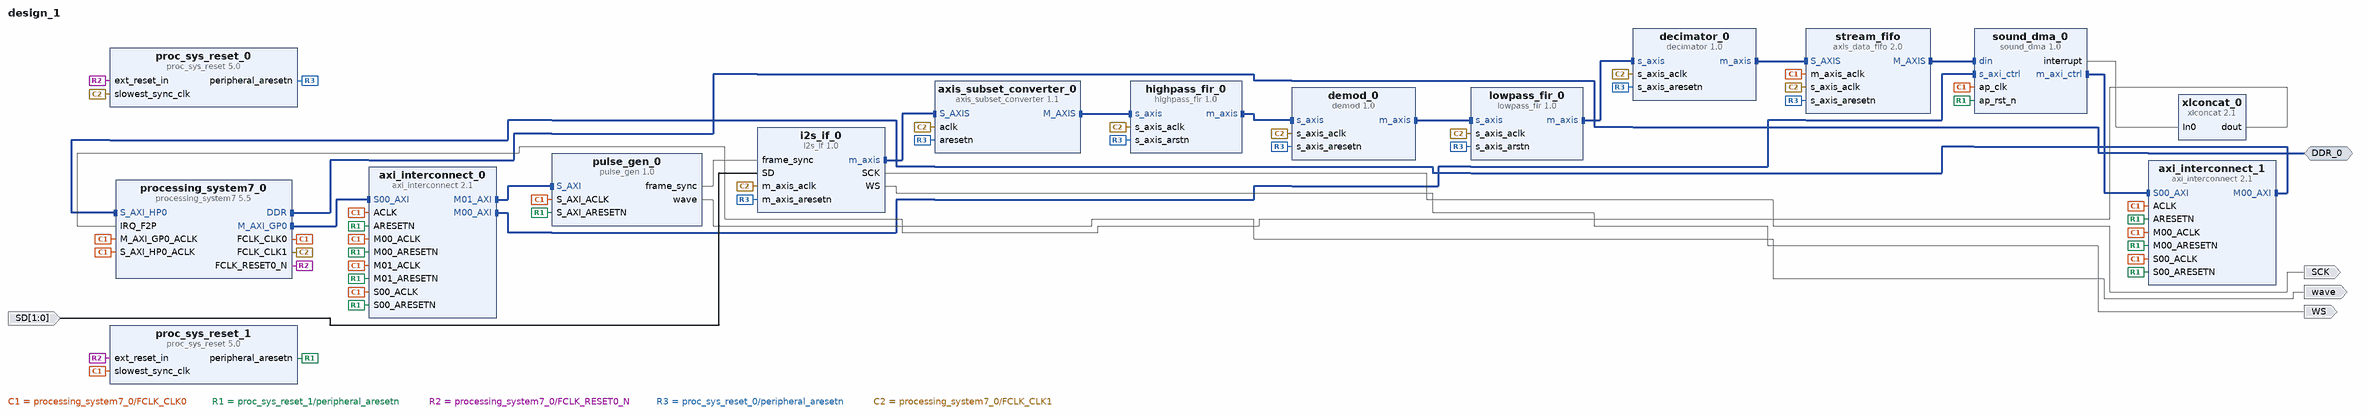
[diagram p0: block diagram of the top level]
# Vivado block design design_1, xc7z010clg400-1, Vivado 2019.1
create_bd_design design_1

create_bd_intf_port -mode Master -vlnv xilinx.com:interface:ddrx_rtl:1.0 DDR_0
create_bd_port -dir I -from 1 -to 0 SD
create_bd_port -dir O SCK
create_bd_port -dir O WS
create_bd_port -dir O wave

create_bd_cell -type ip -vlnv xilinx.com:ip:processing_system7:5.5 processing_system7_0
set_property -dict [list \
  CONFIG.PCW_ENET0_PERIPHERAL_CLKSRC External \
  CONFIG.PCW_ENET0_PERIPHERAL_ENABLE 0 \
  CONFIG.PCW_EN_CLK1_PORT 1 \
  CONFIG.PCW_FCLK_CLK0_BUF FALSE \
  CONFIG.PCW_FPGA0_PERIPHERAL_FREQMHZ 100 \
  CONFIG.PCW_FPGA1_PERIPHERAL_FREQMHZ 64 \
  CONFIG.PCW_FPGA_FCLK1_ENABLE 1 \
  CONFIG.PCW_GPIO_MIO_GPIO_ENABLE 0 \
  CONFIG.PCW_IRQ_F2P_INTR 1 \
  CONFIG.PCW_SD0_PERIPHERAL_ENABLE 0 \
  CONFIG.PCW_UART1_PERIPHERAL_ENABLE 1 \
  CONFIG.PCW_UART1_UART1_IO {MIO 24 .. 25} \
  CONFIG.PCW_UART_PERIPHERAL_FREQMHZ 100 \
  CONFIG.PCW_UIPARAM_DDR_BUS_WIDTH {16 Bit} \
  CONFIG.PCW_UIPARAM_DDR_FREQ_MHZ 533.333 \
  CONFIG.PCW_UIPARAM_DDR_PARTNO {MT41K256M16 RE-125} \
  CONFIG.PCW_USE_FABRIC_INTERRUPT 1 \
  CONFIG.PCW_USE_S_AXI_HP0 1 \
] [get_bd_cells processing_system7_0]
# 79 more settings of processing_system7_0 are not shown: defaults, MIO pin electricals, DDR timing, and values the tool derives
create_bd_cell -type ip -vlnv xilinx.com:ip:proc_sys_reset:5.0 proc_sys_reset_1
create_bd_cell -type ip -vlnv xilinx.com:ip:axi_interconnect:2.1 axi_interconnect_0
set_property -dict [list \
  CONFIG.ENABLE_ADVANCED_OPTIONS 0 \
  CONFIG.NUM_MI 2 \
  CONFIG.S00_HAS_DATA_FIFO 2 \
  CONFIG.STRATEGY 0 \
] [get_bd_cells axi_interconnect_0]
create_bd_cell -type ip -vlnv xilinx.com:ip:proc_sys_reset:5.0 proc_sys_reset_0
create_bd_cell -type ip -vlnv xilinx.com:ip:axis_subset_converter:1.1 axis_subset_converter_0
set_property -dict [list \
  CONFIG.M_TDATA_NUM_BYTES 3 \
  CONFIG.M_TUSER_WIDTH 2 \
  CONFIG.S_TDATA_NUM_BYTES 4 \
  CONFIG.S_TUSER_WIDTH 2 \
  CONFIG.TDATA_REMAP {tdata[30:7]} \
  CONFIG.TUSER_REMAP {tuser[1:0]} \
] [get_bd_cells axis_subset_converter_0]
create_bd_cell -type ip -vlnv xilinx.com:user:demod:1.0 demod_0
create_bd_cell -type ip -vlnv xilinx.com:user:i2s_if:1.0 i2s_if_0
set_property -dict {CONFIG.clkdiv_val 20 CONFIG.fifo_depth 256} [get_bd_cells i2s_if_0]
create_bd_cell -type ip -vlnv xilinx.com:user:decimator:1.0 decimator_0
create_bd_cell -type ip -vlnv xilinx.com:ip:axi_interconnect:2.1 axi_interconnect_1
set_property -dict [list \
  CONFIG.ENABLE_ADVANCED_OPTIONS 0 \
  CONFIG.ENABLE_PROTOCOL_CHECKERS 0 \
  CONFIG.M00_SECURE 0 \
  CONFIG.NUM_MI 1 \
] [get_bd_cells axi_interconnect_1]
create_bd_cell -type ip -vlnv xilinx.com:hls:sound_dma:1.0 sound_dma_0
create_bd_cell -type ip -vlnv xilinx.com:ip:xlconcat:2.1 xlconcat_0
set_property -dict {CONFIG.NUM_PORTS 1} [get_bd_cells xlconcat_0]
create_bd_cell -type ip -vlnv xilinx.com:user:highpass_fir:1.0 highpass_fir_0
create_bd_cell -type ip -vlnv xilinx.com:user:lowpass_fir:1.0 lowpass_fir_0
create_bd_cell -type ip -vlnv xilinx.com:ip:axis_data_fifo:2.0 stream_fifo
set_property -dict {CONFIG.FIFO_DEPTH 16 CONFIG.IS_ACLK_ASYNC 1} [get_bd_cells stream_fifo]
create_bd_cell -type ip -vlnv xilinx.com:user:pulse_gen:1.0 pulse_gen_0
set_property -dict {CONFIG.half_period 2500} [get_bd_cells pulse_gen_0]

# ---- connections ----

connect_bd_intf_net [get_bd_intf_ports DDR_0] [get_bd_intf_pins processing_system7_0/DDR]
connect_bd_intf_net [get_bd_intf_pins axi_interconnect_1/S00_AXI] [get_bd_intf_pins sound_dma_0/m_axi_ctrl]
connect_bd_intf_net [get_bd_intf_pins demod_0/m_axis] [get_bd_intf_pins lowpass_fir_0/s_axis]
connect_bd_intf_net [get_bd_intf_pins axi_interconnect_0/M01_AXI] [get_bd_intf_pins pulse_gen_0/S_AXI]
connect_bd_intf_net [get_bd_intf_pins axi_interconnect_1/M00_AXI] [get_bd_intf_pins processing_system7_0/S_AXI_HP0]
connect_bd_intf_net [get_bd_intf_pins highpass_fir_0/m_axis] [get_bd_intf_pins demod_0/s_axis]
connect_bd_intf_net [get_bd_intf_pins axis_subset_converter_0/M_AXIS] [get_bd_intf_pins highpass_fir_0/s_axis]
connect_bd_intf_net [get_bd_intf_pins axi_interconnect_0/S00_AXI] [get_bd_intf_pins processing_system7_0/M_AXI_GP0]
connect_bd_intf_net [get_bd_intf_pins decimator_0/s_axis] [get_bd_intf_pins lowpass_fir_0/m_axis]
connect_bd_intf_net -intf_net axis_dwidth_converter_0_M_AXIS [get_bd_intf_pins axis_subset_converter_0/S_AXIS] [get_bd_intf_pins i2s_if_0/m_axis]
connect_bd_intf_net [get_bd_intf_pins sound_dma_0/s_axi_ctrl] [get_bd_intf_pins axi_interconnect_0/M00_AXI]
connect_bd_intf_net -intf_net axis_data_fifo_0_M_AXIS [get_bd_intf_pins stream_fifo/M_AXIS] [get_bd_intf_pins sound_dma_0/din]
connect_bd_intf_net [get_bd_intf_pins stream_fifo/S_AXIS] [get_bd_intf_pins decimator_0/m_axis]
connect_bd_net [get_bd_pins processing_system7_0/FCLK_CLK0] \
  [get_bd_pins processing_system7_0/M_AXI_GP0_ACLK] [get_bd_pins proc_sys_reset_1/slowest_sync_clk] \
  [get_bd_pins axi_interconnect_0/S00_ACLK] [get_bd_pins axi_interconnect_0/ACLK] [get_bd_pins axi_interconnect_0/M01_ACLK] \
  [get_bd_pins processing_system7_0/S_AXI_HP0_ACLK] [get_bd_pins axi_interconnect_1/M00_ACLK] \
  [get_bd_pins axi_interconnect_1/ACLK] [get_bd_pins sound_dma_0/ap_clk] [get_bd_pins stream_fifo/m_axis_aclk] \
  [get_bd_pins axi_interconnect_0/M00_ACLK] [get_bd_pins axi_interconnect_1/S00_ACLK] [get_bd_pins pulse_gen_0/S_AXI_ACLK]
connect_bd_net -net processing_system7_0_FCLK_RESET0_N [get_bd_pins proc_sys_reset_1/peripheral_aresetn] \
  [get_bd_pins axi_interconnect_0/S00_ARESETN] [get_bd_pins axi_interconnect_0/ARESETN] \
  [get_bd_pins axi_interconnect_0/M01_ARESETN] [get_bd_pins axi_interconnect_1/M00_ARESETN] \
  [get_bd_pins axi_interconnect_1/ARESETN] [get_bd_pins sound_dma_0/ap_rst_n] [get_bd_pins axi_interconnect_1/S00_ARESETN] \
  [get_bd_pins axi_interconnect_0/M00_ARESETN] [get_bd_pins pulse_gen_0/S_AXI_ARESETN]
connect_bd_net [get_bd_pins processing_system7_0/FCLK_RESET0_N] \
  [get_bd_pins proc_sys_reset_1/ext_reset_in] [get_bd_pins proc_sys_reset_0/ext_reset_in]
connect_bd_net -net SD_0_1 [get_bd_ports SD] [get_bd_pins i2s_if_0/SD]
connect_bd_net [get_bd_pins i2s_if_0/SCK] [get_bd_ports SCK]
connect_bd_net [get_bd_pins i2s_if_0/WS] [get_bd_ports WS]
connect_bd_net [get_bd_pins proc_sys_reset_0/peripheral_aresetn] \
  [get_bd_pins axis_subset_converter_0/aresetn] [get_bd_pins demod_0/s_axis_aresetn] [get_bd_pins i2s_if_0/m_axis_aresetn] \
  [get_bd_pins decimator_0/s_axis_aresetn] [get_bd_pins highpass_fir_0/s_axis_arstn] [get_bd_pins lowpass_fir_0/s_axis_arstn] \
  [get_bd_pins stream_fifo/s_axis_aresetn]
connect_bd_net [get_bd_pins processing_system7_0/FCLK_CLK1] \
  [get_bd_pins proc_sys_reset_0/slowest_sync_clk] [get_bd_pins axis_subset_converter_0/aclk] \
  [get_bd_pins demod_0/s_axis_aclk] [get_bd_pins i2s_if_0/m_axis_aclk] [get_bd_pins decimator_0/s_axis_aclk] \
  [get_bd_pins highpass_fir_0/s_axis_aclk] [get_bd_pins lowpass_fir_0/s_axis_aclk] [get_bd_pins stream_fifo/s_axis_aclk]
connect_bd_net [get_bd_pins pulse_gen_0/wave] [get_bd_ports wave]
connect_bd_net [get_bd_pins pulse_gen_0/frame_sync] [get_bd_pins i2s_if_0/frame_sync]
connect_bd_net [get_bd_pins xlconcat_0/dout] [get_bd_pins processing_system7_0/IRQ_F2P]
connect_bd_net [get_bd_pins sound_dma_0/interrupt] [get_bd_pins xlconcat_0/In0]

# ---- address map ----
assign_bd_address -offset 0x43C10000 -range 64K -target_address_space [get_bd_addr_spaces processing_system7_0/Data] [get_bd_addr_segs pulse_gen_0/S_AXI/reg0]
assign_bd_address -offset 0x43C20000 -range 64K -target_address_space [get_bd_addr_spaces processing_system7_0/Data] [get_bd_addr_segs sound_dma_0/s_axi_ctrl/Reg]
assign_bd_address -offset 0x00000000 -range 512M -target_address_space [get_bd_addr_spaces sound_dma_0/Data_m_axi_ctrl] [get_bd_addr_segs processing_system7_0/S_AXI_HP0/HP0_DDR_LOWOCM]

validate_bd_design
save_bd_design
